# EAGLE schematic main (EAGLE 9.5.0)
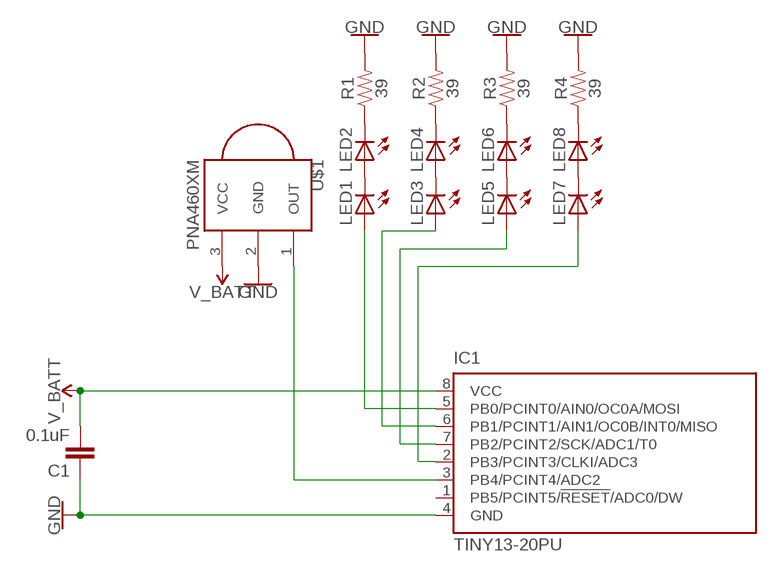
[diagram p0: schematic, sheet 1]

## Parts
C1  0.1uF  0.1UF-KIT-EZ-50V-20%  [CAP-PTH-SMALL-KIT]
IC1  TINY13-20PU  [DIL08]
LED1  LED5MM  [LED5MM]
LED2  LED5MM  [LED5MM]
LED3  LED5MM  [LED5MM]
LED4  LED5MM  [LED5MM]
LED5  LED5MM  [LED5MM]
LED6  LED5MM  [LED5MM]
LED7  LED5MM  [LED5MM]
LED8  LED5MM  [LED5MM]
R1  39  39KOHM-0603-1/10W-1%  [0603]
R2  39  39KOHM-0603-1/10W-1%  [0603]
R3  39  39KOHM-0603-1/10W-1%  [0603]
R4  39  39KOHM-0603-1/10W-1%  [0603]
U$1  PNA460XM  [PNA460XM]

## Nets
GND: C1.1 IC1.4(GND) R1.2 R2.2 R3.2 R4.2 U$1.2(GND)
N$1: LED1.K(C) LED2.A
N$2: LED2.K(C) R1.1
N$3: IC1.3(PB4/PCINT4/ADC2) U$1.1(OUT)
N$4: LED3.K(C) LED4.A
N$5: LED4.K(C) R2.1
N$6: LED5.K(C) LED6.A
N$7: LED6.K(C) R3.1
N$8: LED7.K(C) LED8.A
N$9: LED8.K(C) R4.1
N$10: IC1.5(PB0/PCINT0/AIN0/OC0A/MOSI) LED1.A
N$11: IC1.6(PB1/PCINT1/AIN1/OC0B/INT0/MISO) LED3.A
N$12: IC1.7(PB2/PCINT2/SCK/ADC1/T0) LED5.A
N$13: IC1.2(PB3/PCINT3/CLKI/ADC3) LED7.A
V_BATT: C1.2 IC1.8(VCC) U$1.3(VCC)
Unconnected: IC1.1(PB5/PCINT5/!RESET!/ADC0/DW)

## Library data of the parts
C1 = SparkFun-Capacitors:0.1UF: 0.1µF ceramic capacitors A capacitor is a passive two-terminal electrical component used to store electrical energy temporarily in an electric field.; PROD_ID: CAP-08370
IC1 = atmel:TINY13: 8-bit AVR Microcontroller with 1K Bytes In-System Programmable Flash Source: http://www.atmel.com/dyn/resources/prod_documents/2535S.pdf; MPN: ATTINY13-20PU; OC_FARNELL: 9171550; OC_NEWARK: 96K6521
LED1-LED8 = adafruit:LED: LED OSRAM: - CHIPLED LG R971, LG N971, LY N971, LG Q971, LY Q971, LO R971, LY R971 LH N974, LH R974 LS Q976, LO Q976, LY Q976 LO Q996 - Hyper CHIPLED LW Q18S LB Q993, LB Q99A, LB R99A - SideLED LS A670, LO A670, LY A670, LG A670, LP A670 LB A673, LV A673, LT A673, LW A673 LH A674 LY A675 LS A676, LA A676, LO A676, LY A676, LW A676 LS A679, LY A679, LG A679 - Hyper Micro SIDELED® LS Y876, LA Y876, LO Y876, LY Y876 LT Y87S - SmartLED LW L88C, LW L88S LB L89C, LB L89S, LG L890 LS L89K, LO L89K, LY L89K LS L896, LA L896, LO L896, LY L896 - TOPLED LS T670, LO T670, LY T670, LG T670, LP T670 LSG T670, LSP T670, LSY T670, LOP T670, LYG T670 LG T671, LOG T671, LSG T671 LB T673, LV T673, LT T673, LW T673 LH T674 LS T676, LA T676, LO T676, LY T676, LB T676, LH T676, LSB T676, LW T676 LB T67C, LV T67C, LT T67C, LS T67K, LO T67K, LY T67K, LW E67C LS E67B, LA E67B, LO E67B, LY E67B, LB E67C, LV E67C, LT E67C LW T67C LS T679, LY T679, LG T679 LS T770, LO T770, LY T770, LG T770, LP T770 LB T773, LV T773, LT T773, LW T773 LH T774 LS E675, LA E675, LY E675, LS T675 LS T776, LA T776, LO T776, LY T776, LB T776 LHGB T686 LT T68C, LB T68C - Hyper Mini TOPLED® LB M676 - Mini TOPLED Santana® LG M470 LS M47K, LO M47K, LY M47K Source: http://www.osram.convergy.de/
R1-R4 = SparkFun-Resistors:39KOHM: 39kΩ resistor A resistor is a passive two-terminal electrical component that implements electrical resistance as a circuit element. Resistors act to reduce current flow, and, at the same time, act to lower voltage levels within circuits. - Wikipedia; PROD_ID: RES-12377; VALUE: 39k
U$1 = adafruit:PNA460XM: IR 38KHz receiver PNA4602 and related receivers http://www.ladyada.net/library/pcb/eaglelibrary.html